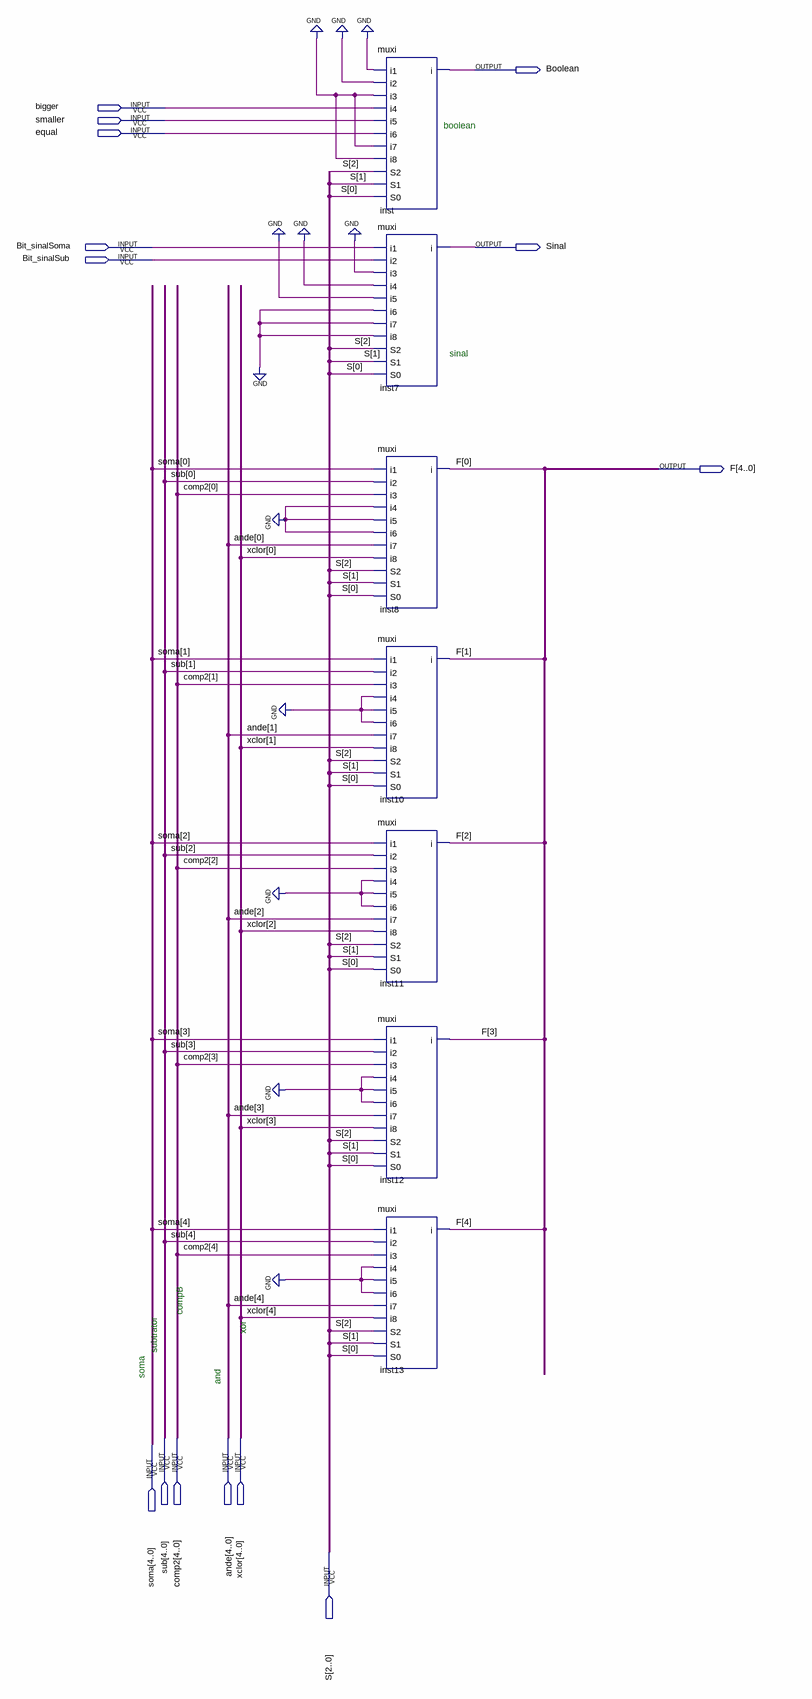
[diagram p0: schematic sheet]
// Quartus schematic result_ula.bdf as structural Verilog: 7 symbols, 14 pins
module result_ula (
  input  bigger,
  input  smaller,
  input  equal,
  input  Bit_sinalSoma,
  input  Bit_sinalSub,
  input  [4:0] sub,
  input  [4:0] comp2,
  input  [4:0] ande,
  input  [4:0] xclor,
  input  [4:0] soma,
  input  [2:0] S,
  output Boolean,
  output Sinal,
  output [4:0] F
);

  muxi inst (
    .i1(1'b0), .i2(1'b0), .i3(1'b0), .i4(bigger), .i5(smaller), .i6(equal), .i7(1'b0), .i8(1'b0), .S2(S[2]),
    .S1(S[1]), .S0(S[0]), .i(Boolean));
  muxi inst7 (
    .i1(Bit_sinalSoma), .i2(Bit_sinalSub), .i3(1'b0), .i4(1'b0), .i5(1'b0), .i6(1'b0), .i7(1'b0), .i8(1'b0),
    .S2(S[2]), .S1(S[1]), .S0(S[0]), .i(Sinal));
  muxi inst8 (
    .i1(soma[0]), .i2(sub[0]), .i3(comp2[0]), .i4(1'b0), .i5(1'b0), .i6(1'b0), .i7(ande[0]), .i8(xclor[0]),
    .S2(S[2]), .S1(S[1]), .S0(S[0]), .i(F[0]));
  muxi inst10 (
    .i1(soma[1]), .i2(sub[1]), .i3(comp2[1]), .i4(1'b0), .i5(1'b0), .i6(1'b0), .i7(ande[1]), .i8(xclor[1]),
    .S2(S[2]), .S1(S[1]), .S0(S[0]), .i(F[1]));
  muxi inst11 (
    .i1(soma[2]), .i2(sub[2]), .i3(comp2[2]), .i4(1'b0), .i5(1'b0), .i6(1'b0), .i7(ande[2]), .i8(xclor[2]),
    .S2(S[2]), .S1(S[1]), .S0(S[0]), .i(F[2]));
  muxi inst12 (
    .i1(soma[3]), .i2(sub[3]), .i3(comp2[3]), .i4(1'b0), .i5(1'b0), .i6(1'b0), .i7(ande[3]), .i8(xclor[3]),
    .S2(S[2]), .S1(S[1]), .S0(S[0]), .i(F[3]));
  muxi inst13 (
    .i1(soma[4]), .i2(sub[4]), .i3(comp2[4]), .i4(1'b0), .i5(1'b0), .i6(1'b0), .i7(ande[4]), .i8(xclor[4]),
    .S2(S[2]), .S1(S[1]), .S0(S[0]), .i(F[4]));

  // Notes on the sheet:
  //   boolean
  //   sinal
  //   compB
  //   subtrator
  //   xor
  //   soma
  //   and
endmodule
